# Altium schematic sheet BoThu.SchDoc
size A; SheetNumber: 2; SheetTotal: 3
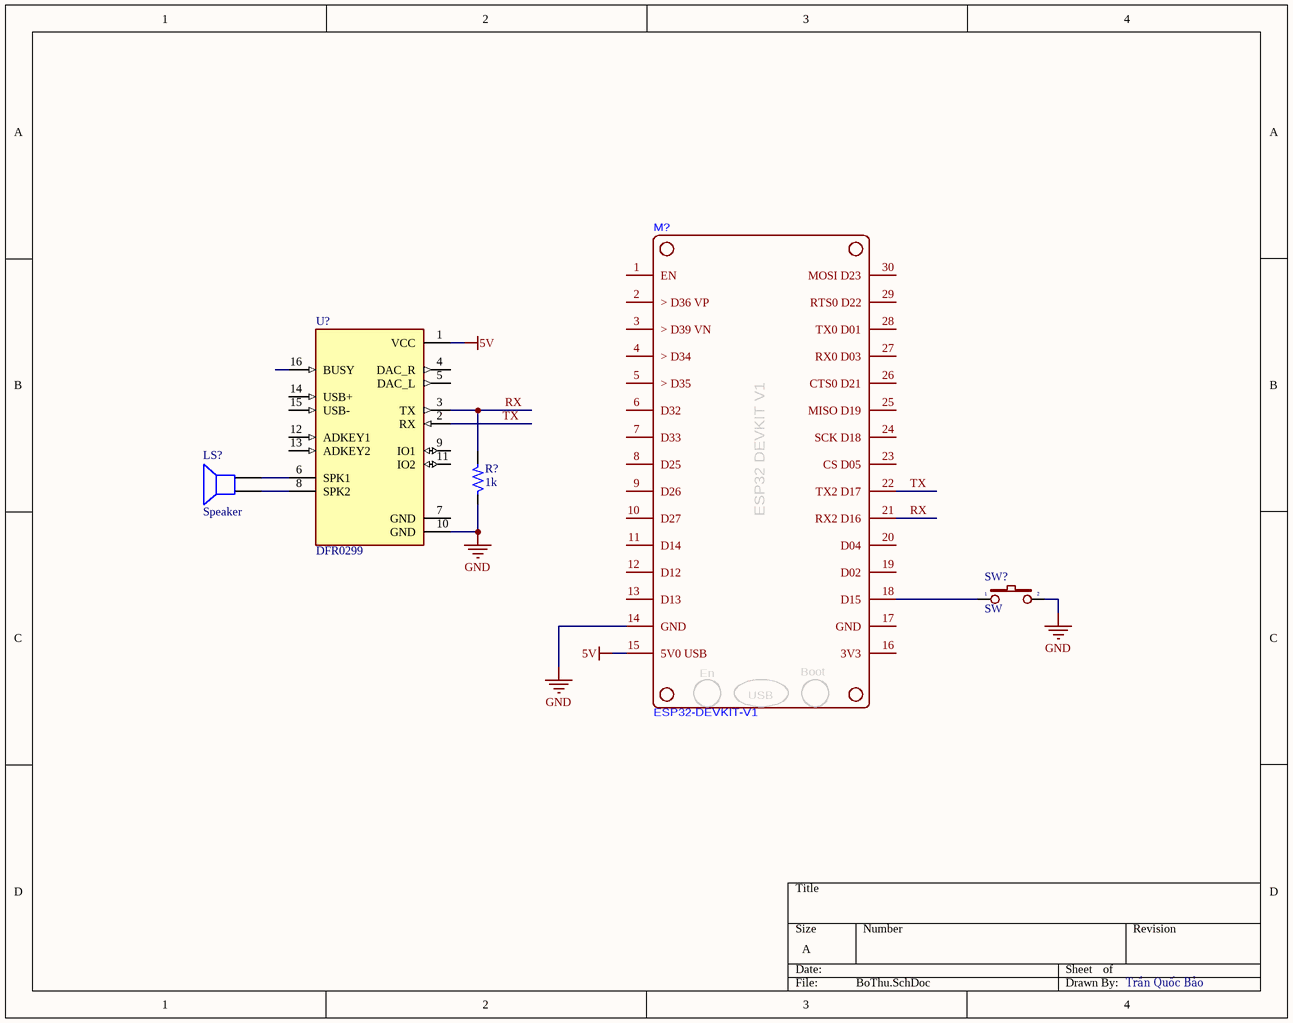
[diagram p0: BoThu.SchDoc]

## Parts
LS?  Speaker  [SPEAKER]
M?  ESP32-DEVKIT-V1  [ESP32]
R?  1k  [R1/8W]
SW?  SW  [SW2]
U?  DFR0299  [MODULE_DFR0299]

## Nets
5V: M?.15(5V0_USB) U?.1(VCC)
GND: M?.14(GND) R?.1 SW?.2 U?.10(GND)
RX: M?.21(RX2_D16) R?.2 U?.3(TX)
TX: M?.22(TX2_D17) U?.2(RX)
NetLS?_1: LS?.1 U?.8(SPK2)
NetLS?_2: LS?.2 U?.6(SPK1)
NetM?_18: M?.18(D15) SW?.1

Not connected (* = marked no-connect by the designer): M? 1(EN) 2(>_D36_VP) 3(>_D39_VN) 4(>_D34) 5(>_D35) 6(D32) 7(D33) 8(D25) 9(D26) 10(D27) 11(D14) 12(D12) 13(D13) 16(3V3) 17(GND) 19(D02) 20(D04) 23(CS_D05) 24(SCK_D18) 25(MISO_D19) 26(CTS0_D21) 27(RX0_D03) 28(TX0_D01) 29(RTS0_D22) 30(MOSI_D23); U? 4(DAC_R) 5(DAC_L) 7(GND) 9(IO1) 11(IO2) 12(ADKEY1) 13(ADKEY2) 14(USB+) 15(USB-) 16(BUSY)

## Notes on the sheet
- Trần Quốc Bảo
- (in symbol ESP32-DEVKIT-V1) ESP32 DEVKIT V1; En; Boot; USB

## Library data of the parts
LS? = Speaker: Loudspeaker; Published: 24-Mar-1999; LatestRevisionDate: 17-Jul-2002; LatestRevisionNote: Re-released for DXP Platform.; PackageReference: PIN2; Publisher: Altium Limited
R? = R: Resistor 1/4W; Value: R1/4W - 1K
SW? = SW2: Switch button 2 pin; Value: SW chip 2 pin
U? = DFR0299: Dfplayer - a Mini Mp3 Player; Package: None; Price: None; Value: *; MP: DFR0299; Availability: Unavailable